# Altium schematic sheet WiFi.SchDoc
size A
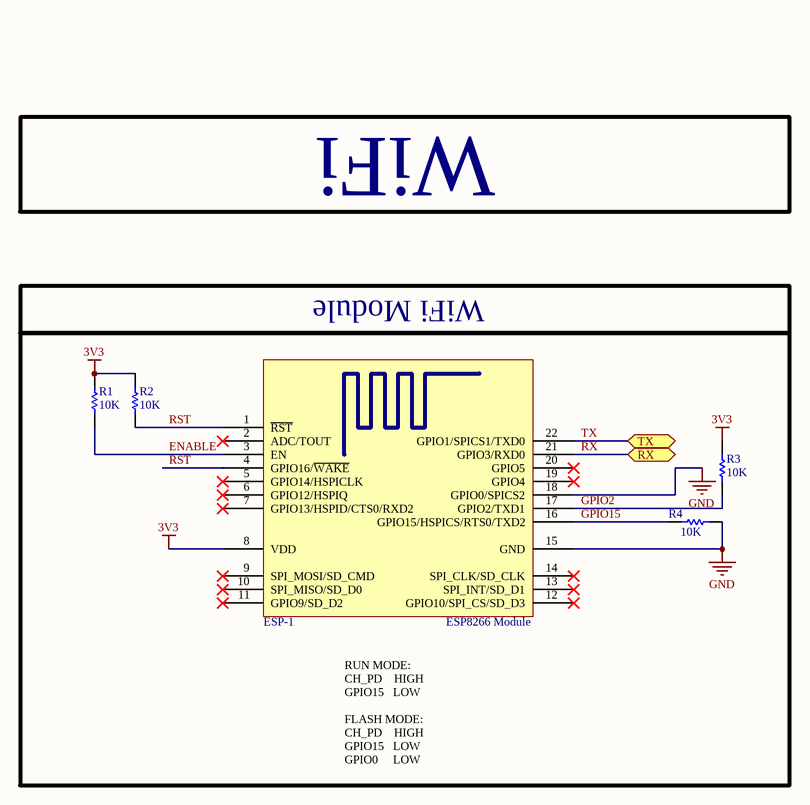
[diagram p0: WiFi.SchDoc]

## Parts
ESP-1  ESP8266 Module  [PCBComponent]
R1  10K  [RESC0805(2012)_L]
R2  10K  [RESC0805(2012)_L]
R3  10K  [RESC0805(2012)_L]
R4  10K  [RESC0805(2012)_L]

## Ports
RX, TX

## Nets
3V3: ESP-1.8(VDD) R1.2 R2.2 R3.2
GND: ESP-1.15(GND) ESP-1.18(GPIO0/SPICS2) R4.1
ENABLE: ESP-1.3(EN) R1.1
GPIO2: ESP-1.17(GPIO2/TXD1) R3.1
GPIO15: ESP-1.16(GPIO15/HSPICS/RTS0/TXD2) R4.2
RST: ESP-1.1(~{RST}) ESP-1.4(GPIO16/~{WAKE}) R2.1
RX: ESP-1.21(GPIO3/RXD0) ; port RX
TX: ESP-1.22(GPIO1/SPICS1/TXD0) ; port TX

Not connected (* = marked no-connect by the designer): ESP-1 2(ADC/TOUT)* 5(GPIO14/HSPICLK)* 6(GPIO12/HSPIQ)* 7(GPIO13/HSPID/CTS0/RXD2)* 9(SPI_MOSI/SD_CMD)* 10(SPI_MISO/SD_D0)* 11(GPIO9/SD_D2)* 12(GPIO10/SPI_CS/SD_D3)* 13(SPI_INT/SD_D1)* 14(SPI_CLK/SD_CLK)* 19(GPIO4)* 20(GPIO5)*

## Notes on the sheet
- WiFi
- WiFi Module
- (near ESP-1) RUN MODE:
  CH_PD    HIGH
  GPIO15   LOW
  FLASH MODE:
  CH_PD    HIGH
  GPIO15   LOW
  GPIO0     LOW

## Library data of the parts
ESP-1 = ESP-12E-A.4
R1-R4 = CMP-1013-00098-1: 10K 0.125W 5% 0805 (2012 Metric)  SMD; Case-EIA: 0805; Case-Metric: 2012; Value: 10000.00 Ohm; Power: 0.125 W; Technology: SMT; Tolerance: 5 %